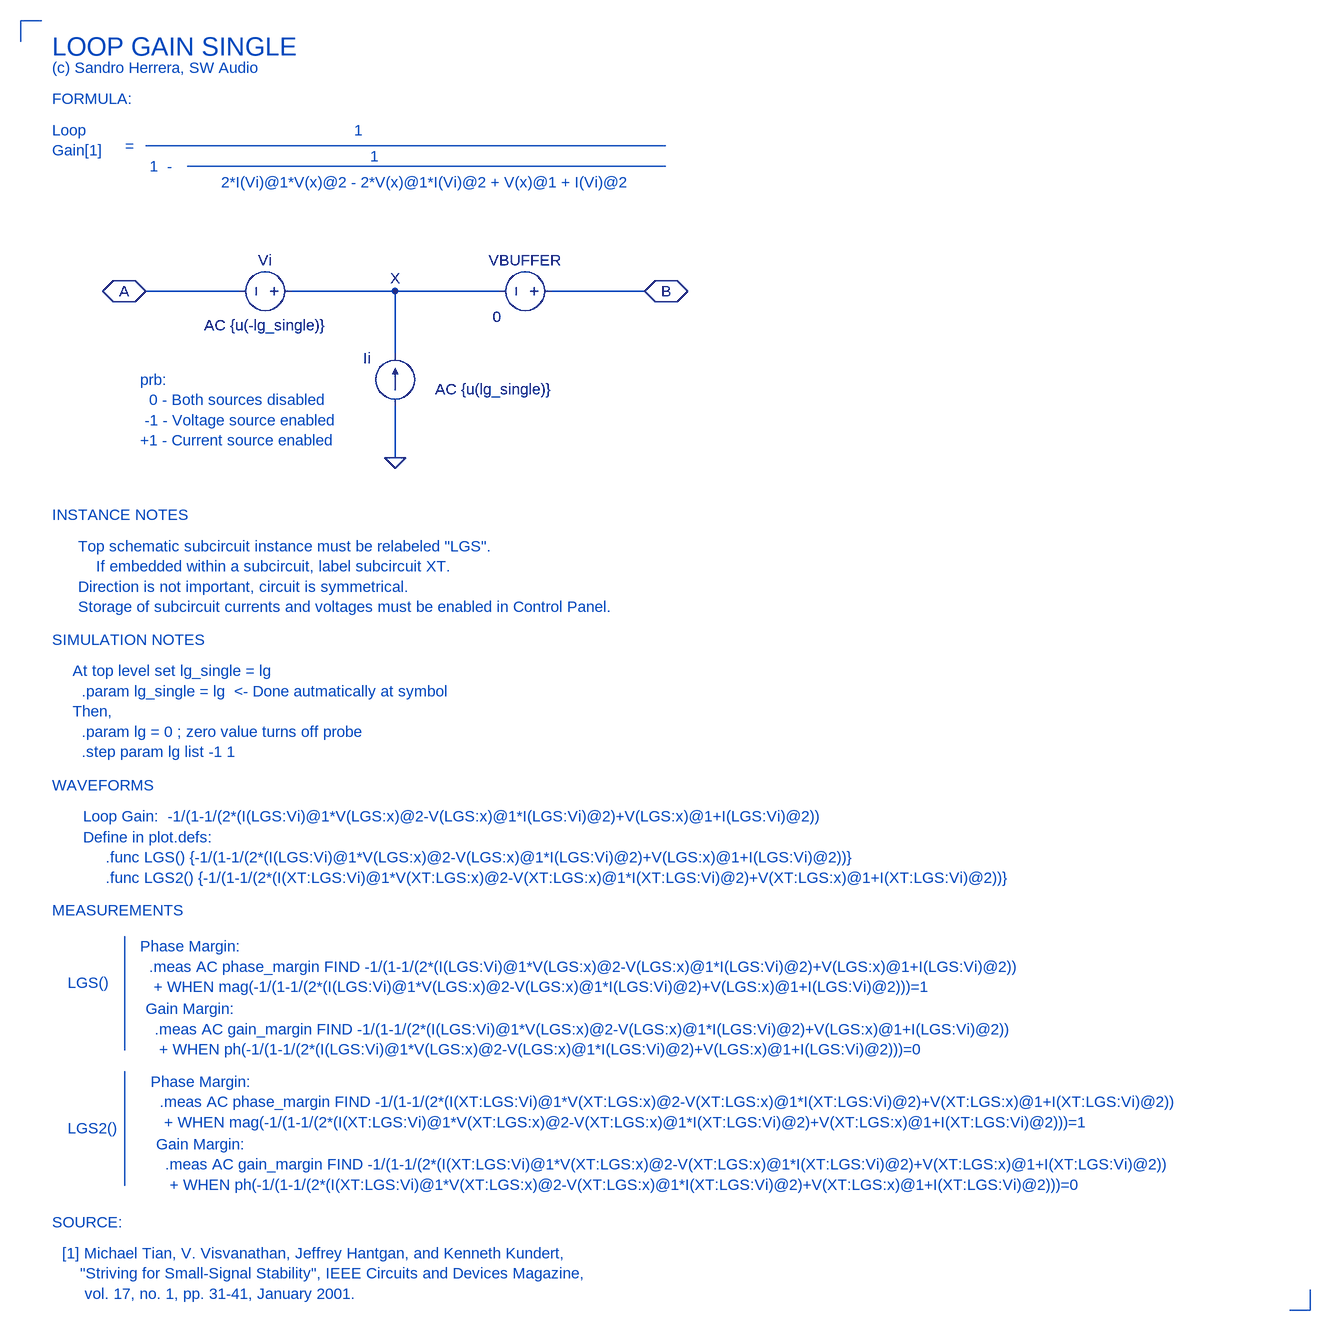
[diagram p0: schematic LG_single.asc]
LG_single.asc, the LTspice schematic file:
Version 4
SHEET 1 1988 2148
WIRE 336 416 192 416
WIRE 576 416 416 416
WIRE 736 416 576 416
WIRE 960 416 816 416
WIRE 576 512 576 416
WIRE 576 672 576 592
FLAG 576 672 0
FLAG 192 416 A
IOPIN 192 416 BiDir
FLAG 960 416 B
IOPIN 960 416 BiDir
FLAG 576 416 X
SYMBOL current 576 592 R180
WINDOW 0 37 73 Left 2
WINDOW 3 24 0 Left 2
WINDOW 123 -243 25 Left 2
WINDOW 39 0 0 Left 0
SYMATTR InstName Ii
SYMATTR Value ""
SYMATTR Value2 AC {u(lg_single)}
SYMBOL voltage 432 416 R90
WINDOW 0 -32 56 VBottom 2
WINDOW 3 74 56 VTop 2
WINDOW 123 37 55 VTop 2
WINDOW 39 0 0 Left 0
SYMATTR InstName Vi
SYMATTR Value ""
SYMATTR Value2 AC {u(-lg_single)}
SYMBOL voltage 832 416 R90
WINDOW 0 -32 56 VBottom 2
WINDOW 3 55 99 VBottom 2
WINDOW 123 37 55 VTop 2
WINDOW 39 0 0 Left 0
SYMATTR InstName VBUFFER
SYMATTR Value 0
TEXT 48 40 Left 4 ;LOOP GAIN SINGLE
TEXT 520 168 Center 2 ;1
TEXT 544 208 Center 2 ;1
TEXT 624 248 Center 2 ;2*I(Vi)@1*V(x)@2 - 2*V(x)@1*I(Vi)@2 + V(x)@1 + I(Vi)@2
TEXT 216 224 Center 2 ;1  -
TEXT 48 168 Left 2 ;Loop\nGain[1]
TEXT 168 192 Center 2 ;=
TEXT 48 120 Left 2 ;FORMULA:
TEXT 184 552 Left 2 ;prb:\n  0 - Both sources disabled\n -1 - Voltage source enabled\n+1 - Current source enabled
TEXT 48 952 Left 2 ;SIMULATION NOTES
TEXT 80 1000 Left 2 ;At top level set lg_single = lg\n  .param lg_single = lg  <- Done autmatically at symbol \nThen,\n  .param lg = 0 ; zero value turns off probe\n  .step param lg list -1 1
TEXT 64 1896 Left 2 ;[1] Michael Tian, V. Visvanathan, Jeffrey Hantgan, and Kenneth Kundert,\n    "Striving for Small-Signal Stability", IEEE Circuits and Devices Magazine,\n     vol. 17, no. 1, pp. 31-41, January 2001.
TEXT 88 808 Left 2 ;Top schematic subcircuit instance must be relabeled "LGS".\n    If embedded within a subcircuit, label subcircuit XT.\nDirection is not important, circuit is symmetrical.\nStorage of subcircuit currents and voltages must be enabled in Control Panel.
TEXT 48 1176 Left 2 ;WAVEFORMS
TEXT 48 1848 Left 2 ;SOURCE:
TEXT 96 1224 Left 2 ;Loop Gain:  -1/(1-1/(2*(I(LGS:Vi)@1*V(LGS:x)@2-V(LGS:x)@1*I(LGS:Vi)@2)+V(LGS:x)@1+I(LGS:Vi)@2))
TEXT 96 1256 Left 2 ;Define in plot.defs:\n     .func LGS() {-1/(1-1/(2*(I(LGS:Vi)@1*V(LGS:x)@2-V(LGS:x)@1*I(LGS:Vi)@2)+V(LGS:x)@1+I(LGS:Vi)@2))}\n     .func LGS2() {-1/(1-1/(2*(I(XT:LGS:Vi)@1*V(XT:LGS:x)@2-V(XT:LGS:x)@1*I(XT:LGS:Vi)@2)+V(XT:LGS:x)@1+I(XT:LGS:Vi)@2))}
TEXT 48 760 Left 2 ;INSTANCE NOTES
TEXT 184 1424 Left 2 ;Phase Margin:\n  .meas AC phase_margin FIND -1/(1-1/(2*(I(LGS:Vi)@1*V(LGS:x)@2-V(LGS:x)@1*I(LGS:Vi)@2)+V(LGS:x)@1+I(LGS:Vi)@2))\n   + WHEN mag(-1/(1-1/(2*(I(LGS:Vi)@1*V(LGS:x)@2-V(LGS:x)@1*I(LGS:Vi)@2)+V(LGS:x)@1+I(LGS:Vi)@2)))=1
TEXT 192 1520 Left 2 ;Gain Margin:\n  .meas AC gain_margin FIND -1/(1-1/(2*(I(LGS:Vi)@1*V(LGS:x)@2-V(LGS:x)@1*I(LGS:Vi)@2)+V(LGS:x)@1+I(LGS:Vi)@2))\n   + WHEN ph(-1/(1-1/(2*(I(LGS:Vi)@1*V(LGS:x)@2-V(LGS:x)@1*I(LGS:Vi)@2)+V(LGS:x)@1+I(LGS:Vi)@2)))=0
TEXT 48 1368 Left 2 ;MEASUREMENTS
TEXT 200 1632 Left 2 ;Phase Margin:\n  .meas AC phase_margin FIND -1/(1-1/(2*(I(XT:LGS:Vi)@1*V(XT:LGS:x)@2-V(XT:LGS:x)@1*I(XT:LGS:Vi)@2)+V(XT:LGS:x)@1+I(XT:LGS:Vi)@2))\n   + WHEN mag(-1/(1-1/(2*(I(XT:LGS:Vi)@1*V(XT:LGS:x)@2-V(XT:LGS:x)@1*I(XT:LGS:Vi)@2)+V(XT:LGS:x)@1+I(XT:LGS:Vi)@2)))=1
TEXT 208 1728 Left 2 ;Gain Margin:\n  .meas AC gain_margin FIND -1/(1-1/(2*(I(XT:LGS:Vi)@1*V(XT:LGS:x)@2-V(XT:LGS:x)@1*I(XT:LGS:Vi)@2)+V(XT:LGS:x)@1+I(XT:LGS:Vi)@2))\n   + WHEN ph(-1/(1-1/(2*(I(XT:LGS:Vi)@1*V(XT:LGS:x)@2-V(XT:LGS:x)@1*I(XT:LGS:Vi)@2)+V(XT:LGS:x)@1+I(XT:LGS:Vi)@2)))=0
TEXT 72 1480 Left 2 ;LGS()
TEXT 72 1704 Left 2 ;LGS2()
TEXT 48 72 Left 2 ;(c) Sandro Herrera, SW Audio
LINE Normal 992 224 256 224
LINE Normal 0 0 0 32
LINE Normal 32 0 0 0
LINE Normal 32 0 32 0 2
LINE Normal 992 192 192 192
LINE Normal 1984 1984 1984 1952
LINE Normal 1952 1984 1984 1984
LINE Normal 1952 1984 1952 1984 2
LINE Normal 160 1584 160 1408
LINE Normal 160 1584 160 1584 2
LINE Normal 160 1792 160 1616
LINE Normal 160 1792 160 1792 2

The netlist it stands for:
* LG_single.asc
Ii 0 X AC {u(lg_single)}
Vi X A AC {u(-lg_single)}
VBUFFER B X 0
* LOOP GAIN SINGLE
* 1
* 1
* 2*I(Vi)@1*V(x)@2 - 2*V(x)@1*I(Vi)@2 + V(x)@1 + I(Vi)@2
* 1  -
* Loop
* Gain[1]
* =
* FORMULA:
* prb:
*   0 - Both sources disabled
*  -1 - Voltage source enabled
* +1 - Current source enabled
* SIMULATION NOTES
* At top level set lg_single = lg
*   .param lg_single = lg  <- Done autmatically at symbol
* Then,
*   .param lg = 0 ; zero value turns off probe
*   .step param lg list -1 1
* [1] Michael Tian, V. Visvanathan, Jeffrey Hantgan, and Kenneth Kundert,
*     "Striving for Small-Signal Stability", IEEE Circuits and Devices Magazine,
*      vol. 17, no. 1, pp. 31-41, January 2001.
* Top schematic subcircuit instance must be relabeled "LGS".
*     If embedded within a subcircuit, label subcircuit XT.
* Direction is not important, circuit is symmetrical.
* Storage of subcircuit currents and voltages must be enabled in Control Panel.
* WAVEFORMS
* SOURCE:
* Loop Gain:  -1/(1-1/(2*(I(LGS:Vi)@1*V(LGS:x)@2-V(LGS:x)@1*I(LGS:Vi)@2)+V(LGS:x)@1+I(LGS:Vi)@2))
* Define in plot.defs:
*      .func LGS() {-1/(1-1/(2*(I(LGS:Vi)@1*V(LGS:x)@2-V(LGS:x)@1*I(LGS:Vi)@2)+V(LGS:x)@1+I(LGS:Vi)@2))}
*      .func LGS2() {-1/(1-1/(2*(I(XT:LGS:Vi)@1*V(XT:LGS:x)@2-V(XT:LGS:x)@1*I(XT:LGS:Vi)@2)+V(XT:LGS:x)@1+I(XT:LGS:Vi)@2))}
* INSTANCE NOTES
* Phase Margin:
*   .meas AC phase_margin FIND -1/(1-1/(2*(I(LGS:Vi)@1*V(LGS:x)@2-V(LGS:x)@1*I(LGS:Vi)@2)+V(LGS:x)@1+I(LGS:Vi)@2))
*    + WHEN mag(-1/(1-1/(2*(I(LGS:Vi)@1*V(LGS:x)@2-V(LGS:x)@1*I(LGS:Vi)@2)+V(LGS:x)@1+I(LGS:Vi)@2)))=1
* Gain Margin:
*   .meas AC gain_margin FIND -1/(1-1/(2*(I(LGS:Vi)@1*V(LGS:x)@2-V(LGS:x)@1*I(LGS:Vi)@2)+V(LGS:x)@1+I(LGS:Vi)@2))
*    + WHEN ph(-1/(1-1/(2*(I(LGS:Vi)@1*V(LGS:x)@2-V(LGS:x)@1*I(LGS:Vi)@2)+V(LGS:x)@1+I(LGS:Vi)@2)))=0
* MEASUREMENTS
* Phase Margin:
*   .meas AC phase_margin FIND -1/(1-1/(2*(I(XT:LGS:Vi)@1*V(XT:LGS:x)@2-V(XT:LGS:x)@1*I(XT:LGS:Vi)@2)+V(XT:LGS:x)@1+I(XT:LGS:Vi)@2))
*    + WHEN mag(-1/(1-1/(2*(I(XT:LGS:Vi)@1*V(XT:LGS:x)@2-V(XT:LGS:x)@1*I(XT:LGS:Vi)@2)+V(XT:LGS:x)@1+I(XT:LGS:Vi)@2)))=1
* Gain Margin:
*   .meas AC gain_margin FIND -1/(1-1/(2*(I(XT:LGS:Vi)@1*V(XT:LGS:x)@2-V(XT:LGS:x)@1*I(XT:LGS:Vi)@2)+V(XT:LGS:x)@1+I(XT:LGS:Vi)@2))
*    + WHEN ph(-1/(1-1/(2*(I(XT:LGS:Vi)@1*V(XT:LGS:x)@2-V(XT:LGS:x)@1*I(XT:LGS:Vi)@2)+V(XT:LGS:x)@1+I(XT:LGS:Vi)@2)))=0
* LGS()
* LGS2()
* (c) Sandro Herrera, SW Audio
.backanno
.end